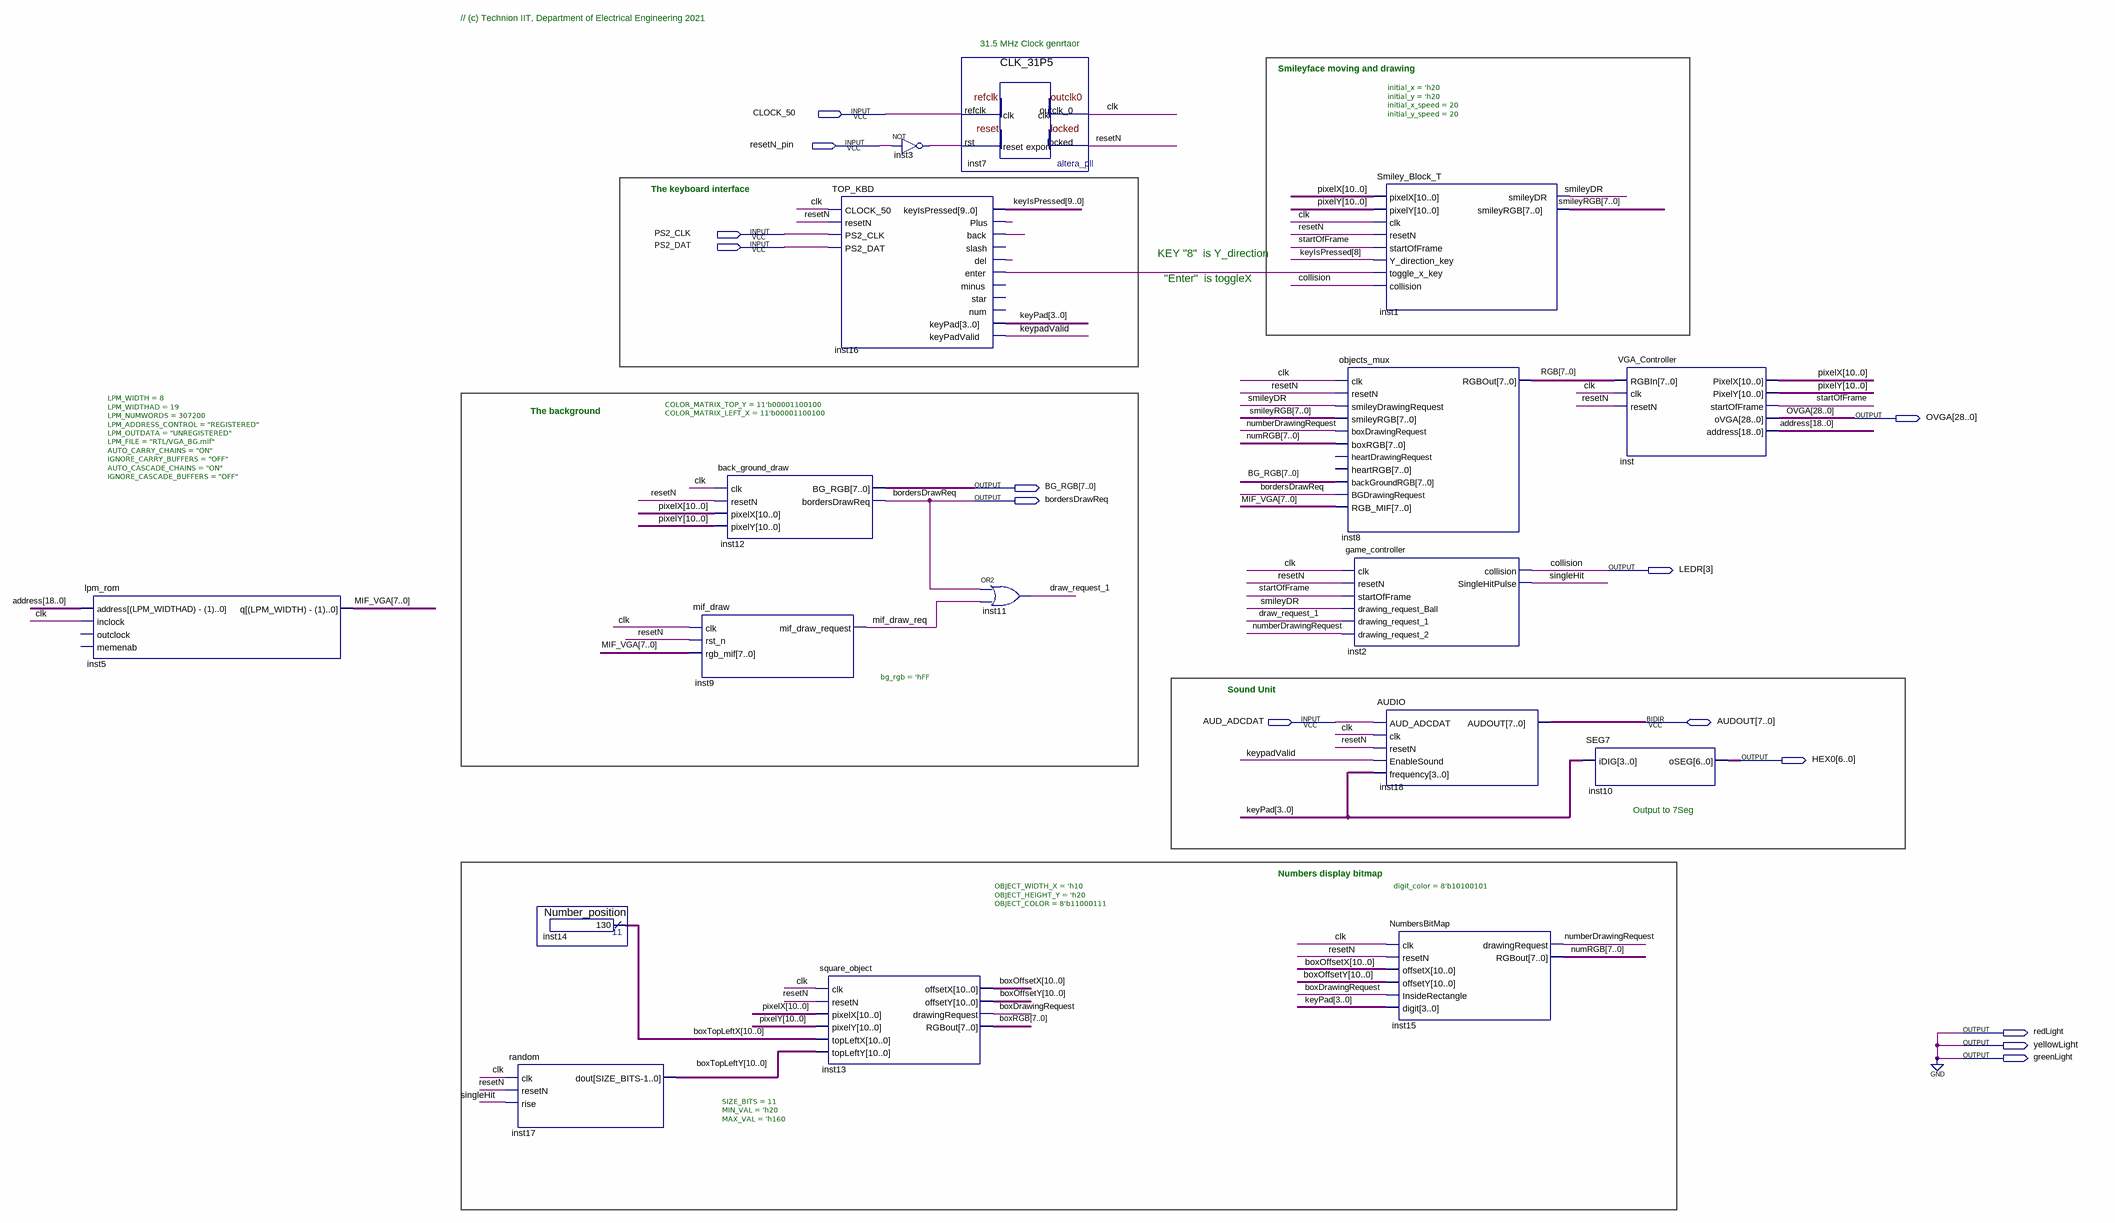
[diagram p0: schematic sheet]
// Quartus schematic TOP.bdf as structural Verilog: 17 symbols, 14 pins
module TOP (
  input  CLOCK_50,
  input  resetN_pin,
  input  PS2_CLK,
  input  PS2_DAT,
  input  AUD_ADCDAT,
  inout  [7:0] AUDOUT,
  output [28:0] OVGA,
  output [7:0] BG_RGB,
  output bordersDrawReq,
  output [3:3] LEDR,
  output [6:0] HEX0,
  output redLight,
  output yellowLight,
  output greenLight
);

  wire boxDrawingRequest, clk, draw_request_1, inst3_out, inst16_back, inst16_del, inst16_enter, inst16_plus,
       keypadValid, mif_draw_req, numberDrawingRequest, resetN, singleHit, smileyDR, startOfFrame;
  wire [3:0] keyPad;
  wire [7:0] boxRGB, MIF_VGA, numRGB, RGB, smileyRGB;
  wire [9:0] keyIsPressed;
  wire [10:0] boxOffsetX, boxOffsetY, boxTopLeftX, boxTopLeftY, pixelX, pixelY;
  wire [18:0] address;

  lpm_rom #(.LPM_WIDTH(8), .LPM_WIDTHAD(19), .LPM_NUMWORDS(307200), .LPM_ADDRESS_CONTROL("REGISTERED"), .LPM_OUTDATA("UNREGISTERED"), .LPM_FILE("RTL/VGA_BG.mif"), .AUTO_CARRY_CHAINS("ON"), .IGNORE_CARRY_BUFFERS("OFF"), .AUTO_CASCADE_CHAINS("ON"), .IGNORE_CASCADE_BUFFERS("OFF")) inst5 (
    .address(address), .inclock(clk), .q(MIF_VGA));  // open: outclock, memenab
  Number_position inst14 (.result(boxTopLeftX));
  random #(.SIZE_BITS(11), .MIN_VAL('h20), .MAX_VAL('h160)) inst17 (
    .clk(clk), .resetN(resetN), .rise(singleHit), .dout(boxTopLeftY));
  mif_draw #(.bg_rgb('hFF)) inst9 (.clk(clk), .rst_n(resetN), .rgb_mif(MIF_VGA), .mif_draw_request(mif_draw_req));
  back_ground_draw #(.COLOR_MATRIX_TOP_Y(11'b00001100100), .COLOR_MATRIX_LEFT_X(11'b00001100100)) inst12 (
    .clk(clk), .resetN(resetN), .pixelX(pixelX), .pixelY(pixelY), .BG_RGB(BG_RGB),
    .bordersDrawReq(bordersDrawReq));
  TOP_KBD inst16 (
    .CLOCK_50(clk), .resetN(resetN), .PS2_CLK(PS2_CLK), .PS2_DAT(PS2_DAT), .keyIsPressed(keyIsPressed),
    .Plus(inst16_plus), .back(inst16_back), .del(inst16_del), .enter(inst16_enter), .keyPad(keyPad),
    .keyPadValid(keypadValid));  // open: slash, minus, star, num
  square_object #(.OBJECT_WIDTH_X('h10), .OBJECT_HEIGHT_Y('h20), .OBJECT_COLOR(8'b11000111)) inst13 (
    .clk(clk), .resetN(resetN), .pixelX(pixelX), .pixelY(pixelY), .topLeftX(boxTopLeftX),
    .topLeftY(boxTopLeftY), .offsetX(boxOffsetX), .offsetY(boxOffsetY), .drawingRequest(boxDrawingRequest),
    .RGBout(boxRGB));
  not inst3 (inst3_out, resetN_pin);
  CLK_31P5 inst7 (.refclk(CLOCK_50), .rst(inst3_out), .outclk_0(clk), .locked(resetN));
  or inst11 (draw_request_1, bordersDrawReq, mif_draw_req);
  objects_mux inst8 (
    .clk(clk), .resetN(resetN), .smileyDrawingRequest(smileyDR), .smileyRGB(smileyRGB),
    .boxDrawingRequest(numberDrawingRequest), .boxRGB(numRGB), .backGroundRGB(BG_RGB),
    .BGDrawingRequest(bordersDrawReq), .RGB_MIF(MIF_VGA), .RGBOut(RGB));  // open: heartDrawingRequest, heartRGB
  game_controller inst2 (
    .clk(clk), .resetN(resetN), .startOfFrame(startOfFrame), .drawing_request_Ball(smileyDR),
    .drawing_request_1(draw_request_1), .drawing_request_2(numberDrawingRequest), .collision(LEDR[3]),
    .SingleHitPulse(singleHit));
  Smiley_Block_T #(.initial_x('h20), .initial_y('h20), .initial_x_speed(20), .initial_y_speed(20)) inst1 (
    .pixelX(pixelX), .pixelY(pixelY), .clk(clk), .resetN(resetN), .startOfFrame(startOfFrame),
    .Y_direction_key(keyIsPressed[8]), .toggle_x_key(inst16_enter), .collision(LEDR[3]), .smileyDR(smileyDR),
    .smileyRGB(smileyRGB));
  AUDIO inst18 (
    .AUD_ADCDAT(AUD_ADCDAT), .clk(clk), .resetN(resetN), .EnableSound(keypadValid), .frequency(keyPad),
    .AUDOUT(AUDOUT));
  NumbersBitMap #(.digit_color(8'b10100101)) inst15 (
    .clk(clk), .resetN(resetN), .offsetX(boxOffsetX), .offsetY(boxOffsetY),
    .InsideRectangle(boxDrawingRequest), .digit(keyPad), .drawingRequest(numberDrawingRequest),
    .RGBout(numRGB));
  VGA_Controller inst (
    .RGBIn(RGB), .clk(clk), .resetN(resetN), .PixelX(pixelX), .PixelY(pixelY), .startOfFrame(startOfFrame),
    .oVGA(OVGA), .address(address));
  SEG7 inst10 (.iDIG(keyPad), .oSEG(HEX0));

  assign greenLight = 1'b0;
  assign redLight = 1'b0;
  assign yellowLight = 1'b0;

  // Other names for the same wires on the sheet: collision = LEDR[3]

  // Notes on the sheet:
  //   // (c) Technion IIT, Department of Electrical Engineering 2021
  //   31.5 MHz Clock genrtaor
  //   Smileyface moving and drawing
  //   The keyboard interface
  //   KEY "8"  is Y_direction
  //   "Enter"  is toggleX
  //   The background
  //   Sound Unit
  //   Output to 7Seg
  //   Numbers display bitmap
endmodule
